# Altium project LimeSDR-USB_1v4.PrjPcb (part 4 of 8)

## Sheet FPGA.SchDoc: title
size A3; Author: NeoExiZ; CompanyName: BUPT CPS Lab; Engineer: NeoExiZ; Organization: NeoExiZ; Address1: 418, 4#Building,BUPT; Address2: No.10, Xitucheng Road; Address3: Beijing; Address4: China
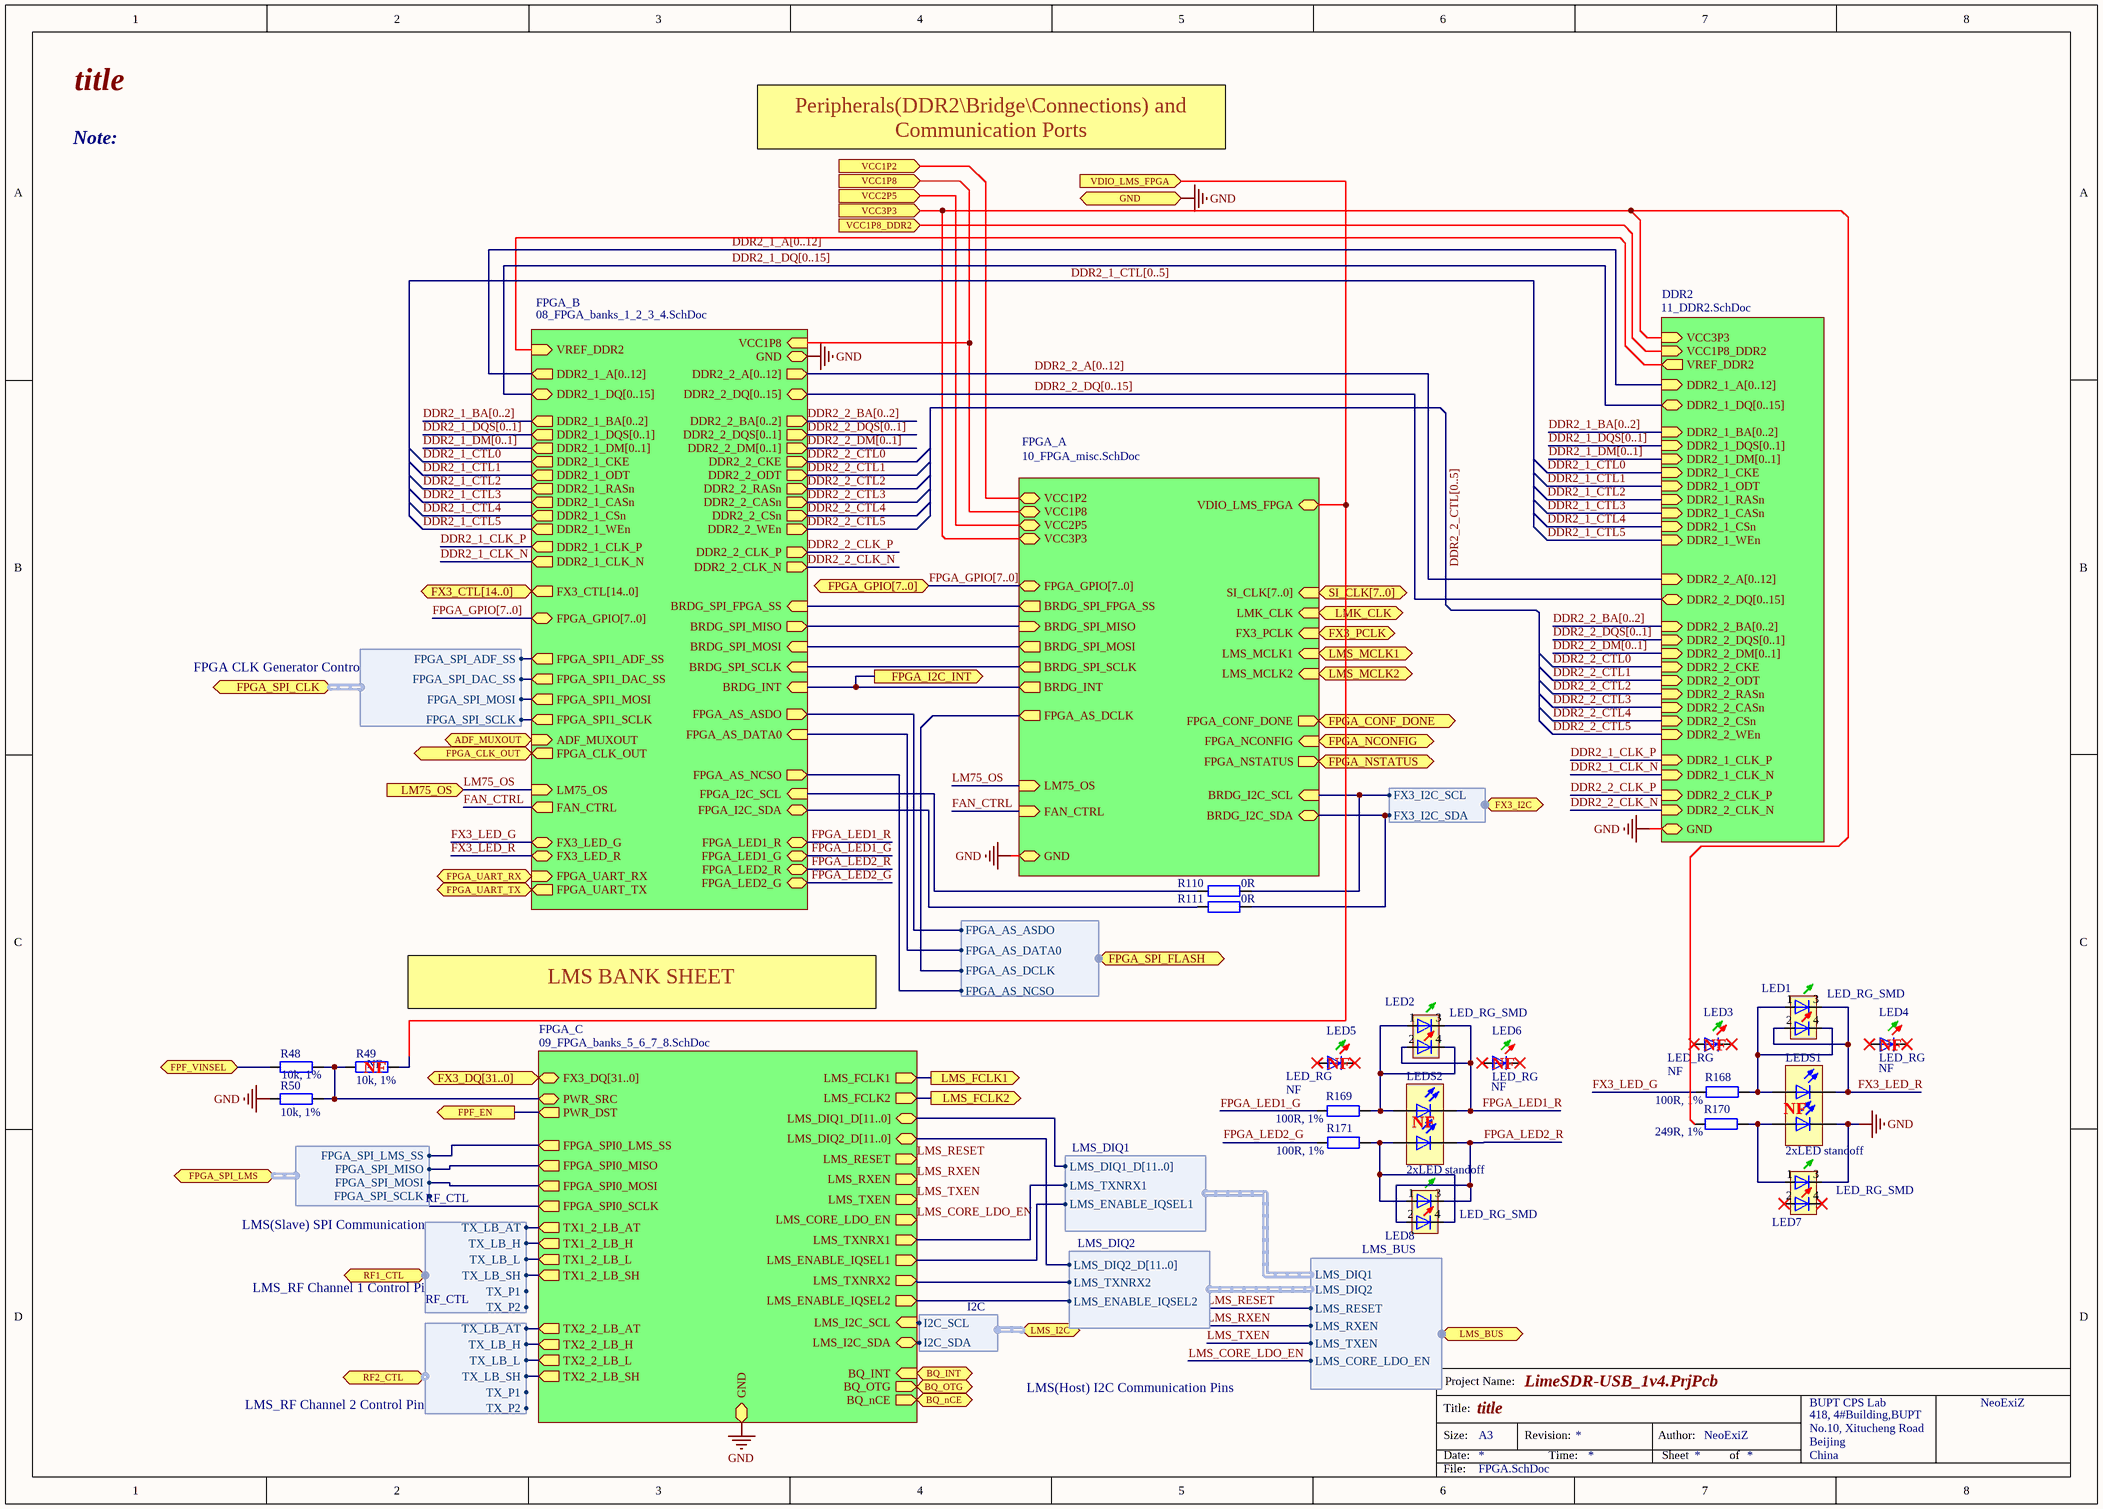
[diagram p6: FPGA.SchDoc]

### Parts
LED1  LED_RG_SMD  [LED-2x0603]
LED2  LED_RG_SMD  [LED-2x0603]
LED3  LED_RG  Assembly Info: NF  (mechanical)
LED4  LED_RG  Assembly Info: NF  (mechanical)
LED5  LED_RG  Assembly Info: NF  (mechanical)
LED6  LED_RG  Assembly Info: NF  (mechanical)
LED7  LED_RG_SMD  [LED-2x0603]
LED8  LED_RG_SMD  [LED-2x0603]
LEDS1  2xLED standoff  [LED_STANDOFF_H-201C]
LEDS2  2xLED standoff  [LED_STANDOFF_H-201C]
R48  10k, 1%  [RES0402]
R49  10k, 1%  Assembly Info: NF  [RES0402]
R50  10k, 1%  [RES0402]
R110  0R  [RES0402]
R111  0R  [RES0402]
R168  100R, 1%  [RES0402]
R169  100R, 1%  [RES0402]
R170  249R, 1%  [RES0402]
R171  100R, 1%  [RES0402]

### Sub-sheets
DDR2 = 11_DDR2.SchDoc: DDR2_1_ODT (in), DDR2_1_RASn (in), DDR2_1_WEn (in), DDR2_1_CKE (in), DDR2_1_CSn (in), DDR2_1_CASn (in), DDR2_1_BA[0..2] (in), DDR2_1_DM[0..1] (in), DDR2_1_DQS[0..1] (in), DDR2_1_A[0..12] (in), DDR2_1_DQ[0..15] (bidir), VCC1P8_DDR2 (in), VCC3P3 (in), VREF_DDR2 (out), DDR2_2_BA[0..2] (in), DDR2_2_CASn (in), DDR2_2_CKE (in), DDR2_2_CSn (in), DDR2_2_ODT (in), DDR2_2_RASn (in), DDR2_2_WEn (in), DDR2_2_DM[0..1] (in), DDR2_2_DQS[0..1] (in), DDR2_2_DQ[0..15] (bidir), DDR2_2_A[0..12] (in), DDR2_1_CLK_P (in), DDR2_1_CLK_N (in), DDR2_2_CLK_N (in), DDR2_2_CLK_P (in), GND
FPGA_A = 10_FPGA_misc.SchDoc: FX3_PCLK (in), SI_CLK[7..0] (in), FPGA_GPIO[7..0] (bidir), LMK_CLK (in), LMS_MCLK1 (in), LMS_MCLK2 (in), FPGA_AS_DCLK (out), FPGA_CONF_DONE (out), FPGA_NCONFIG (in), FPGA_NSTATUS (out), BRDG_SPI_FPGA_SS (out), BRDG_SPI_MISO (in), BRDG_SPI_MOSI (out), BRDG_SPI_SCLK (out), BRDG_INT (out), BRDG_I2C_SCL (in), BRDG_I2C_SDA (bidir), LM75_OS (in), FAN_CTRL (in), VCC1P2, VCC1P8, VCC3P3, VDIO_LMS_FPGA, VCC2P5, GND
FPGA_B = 08_FPGA_banks_1_2_3_4.SchDoc: FX3_CTL[14..0] (out), FPGA_GPIO[7..0] (bidir), BRDG_INT (in), BRDG_SPI_FPGA_SS (in), BRDG_SPI_MISO (out), BRDG_SPI_MOSI (in), BRDG_SPI_SCLK (in), FPGA_SPI1_ADF_SS (out), FPGA_SPI1_DAC_SS (out), FPGA_SPI1_MOSI (out), FPGA_SPI1_SCLK (out), FPGA_CLK_OUT (out), FPGA_AS_ASDO (out), FPGA_AS_DATA0 (in), FPGA_AS_NCSO (out), LM75_OS (in), FAN_CTRL (out), FPGA_I2C_SCL (in), FPGA_I2C_SDA (bidir), DDR2_1_ODT (out), DDR2_1_RASn (out), DDR2_1_WEn (out), DDR2_2_BA[0..2] (out), DDR2_2_CASn (out), DDR2_2_CKE (out), DDR2_2_CSn (out), DDR2_2_ODT (out), DDR2_2_RASn (out), DDR2_2_WEn (out), DDR2_1_CKE (out), DDR2_1_CSn (out), DDR2_1_CASn (out), DDR2_1_BA[0..2] (out), DDR2_1_DM[0..1] (out), DDR2_2_DM[0..1] (out), DDR2_2_DQS[0..1] (out), DDR2_1_DQS[0..1] (out), DDR2_1_A[0..12] (out), DDR2_1_DQ[0..15] (bidir), DDR2_2_DQ[0..15] (bidir), DDR2_2_A[0..12] (out), VREF_DDR2 (in), DDR2_2_CLK_N (out), DDR2_2_CLK_P (out), DDR2_1_CLK_N (out), DDR2_1_CLK_P (out), FPGA_LED1_R, FPGA_LED1_G, FPGA_LED2_G, FPGA_LED2_R, FX3_LED_G, FX3_LED_R, FPGA_UART_RX (in), FPGA_UART_TX (out), ADF_MUXOUT (in), VCC1P8 (in), GND
FPGA_C = 09_FPGA_banks_5_6_7_8.SchDoc: FX3_DQ[31..0] (bidir), LMS_FCLK2 (out), LMS_FCLK1 (out), LMS_DIQ1_D[11..0] (bidir), LMS_DIQ2_D[11..0] (bidir), FPGA_SPI0_MISO (out), FPGA_SPI0_MOSI (out), FPGA_SPI0_SCLK (out), FPGA_SPI0_LMS_SS (out), LMS_RESET (out), LMS_RXEN (out), LMS_TXEN (out), LMS_TXNRX1 (out), LMS_TXNRX2 (out), LMS_ENABLE_IQSEL1 (out), LMS_ENABLE_IQSEL2 (out), LMS_CORE_LDO_EN (out), LMS_I2C_SCL (in), LMS_I2C_SDA (bidir), TX1_2_LB_AT (out), TX1_2_LB_H (out), TX1_2_LB_L (out), TX1_2_LB_SH (out), TX2_2_LB_AT (out), TX2_2_LB_H (out), TX2_2_LB_L (out), TX2_2_LB_SH (out), PWR_SRC (bidir), GND, BQ_nCE (out), BQ_OTG (out), BQ_INT (in), PWR_DST (out)

### Ports
ADF_MUXOUT (in), BQ_INT (in), BQ_nCE (out), BQ_OTG (out), FPF_EN (out), FPF_VINSEL (bidir), FPGA_CLK_OUT (out), FPGA_CONF_DONE (out), FPGA_GPIO[7..0] (bidir), FPGA_I2C_INT (out), FPGA_NCONFIG (in), FPGA_NSTATUS (out), FPGA_SPI_CLK (harness FPGA_SPI_CLK), FPGA_SPI_FLASH (harness FPGA_SPI_FLASH), FPGA_SPI_LMS (harness FPGA_SPI_LMS), FPGA_UART_RX (in), FPGA_UART_TX (out), FX3_CTL[14..0] (out), FX3_DQ[31..0] (bidir), FX3_I2C (harness FX3_I2C), FX3_PCLK (in), GND, LM75_OS (in), LMK_CLK (in), LMS_BUS (harness LMS_BUS), LMS_FCLK1 (out), LMS_FCLK2 (out), LMS_I2C (harness I2C), LMS_MCLK1 (in), LMS_MCLK2 (in), RF1_CTL (harness RF_CTL), RF2_CTL (harness RF_CTL), SI_CLK[7..0] (in), VCC1P2 (in), VCC1P8 (in), VCC1P8_DDR2 (in), VCC2P5 (in), VCC3P3 (in), VDIO_LMS_FPGA (in)

### Harnesses
FPGA_SPI_CLK: FPGA_SPI_SCLK, FPGA_SPI_MOSI, FPGA_SPI_DAC_SS, FPGA_SPI_ADF_SS
FX3_I2C: FX3_I2C_SCL, FX3_I2C_SDA
FPGA_SPI_FLASH: FPGA_AS_ASDO, FPGA_AS_DATA0, FPGA_AS_DCLK, FPGA_AS_NCSO
FPGA_SPI_LMS: FPGA_SPI_LMS_SS, FPGA_SPI_MISO, FPGA_SPI_MOSI, FPGA_SPI_SCLK
I2C: I2C_SCL, I2C_SDA
LMS_DIQ1: LMS_DIQ1_D[11..0], LMS_TXNRX1, LMS_ENABLE_IQSEL1
LMS_DIQ2: LMS_DIQ2_D[11..0], LMS_TXNRX2, LMS_ENABLE_IQSEL2
LMS_BUS: LMS_DIQ1, LMS_DIQ2, LMS_RESET, LMS_RXEN, LMS_TXEN, LMS_CORE_LDO_EN
RF_CTL: TX_LB_AT, TX_LB_H, TX_LB_L, TX_LB_SH, TX_P1, TX_P2

### Nets
GND: LED7.3 LEDS1.K2(C) R50.1 ; port GND, sheet FPGA_C/GND, sheet FPGA_B/GND, sheet FPGA_A/GND, sheet DDR2/GND
VCC_P0: port VCC1P2, sheet FPGA_A/VCC1P2
VCC_P2: port VCC2P5, sheet FPGA_A/VCC2P5
VCC_P3: R170.1 ; port VCC3P3, sheet FPGA_A/VCC3P3, sheet DDR2/VCC3P3
VDIO_LMS_FPGA: R49.2 ; port VDIO_LMS_FPGA, sheet FPGA_A/VDIO_LMS_FPGA
VREF_DDR2: sheet FPGA_B/VREF_DDR2, sheet DDR2/VREF_DDR2
BQ_INT: port BQ_INT, sheet FPGA_C/BQ_INT
BQ_nCE: port BQ_nCE, sheet FPGA_C/BQ_nCE
BQ_OTG: port BQ_OTG, sheet FPGA_C/BQ_OTG
DDR2_1_CLK_N: sheet FPGA_B/DDR2_1_CLK_N, sheet DDR2/DDR2_1_CLK_N
DDR2_1_CLK_P: sheet FPGA_B/DDR2_1_CLK_P, sheet DDR2/DDR2_1_CLK_P
DDR2_1_CTL0: sheet FPGA_B/DDR2_1_CKE, sheet DDR2/DDR2_1_CKE
DDR2_1_CTL1: sheet FPGA_B/DDR2_1_ODT, sheet DDR2/DDR2_1_ODT
DDR2_1_CTL2: sheet FPGA_B/DDR2_1_RASn, sheet DDR2/DDR2_1_RASn
DDR2_1_CTL3: sheet FPGA_B/DDR2_1_CASn, sheet DDR2/DDR2_1_CASn
DDR2_1_CTL4: sheet FPGA_B/DDR2_1_CSn, sheet DDR2/DDR2_1_CSn
DDR2_1_CTL5: sheet FPGA_B/DDR2_1_WEn, sheet DDR2/DDR2_1_WEn
DDR2_2_CLK_N: sheet FPGA_B/DDR2_2_CLK_N, sheet DDR2/DDR2_2_CLK_N
DDR2_2_CLK_P: sheet FPGA_B/DDR2_2_CLK_P, sheet DDR2/DDR2_2_CLK_P
DDR2_2_CTL0: sheet FPGA_B/DDR2_2_CKE, sheet DDR2/DDR2_2_CKE
DDR2_2_CTL1: sheet FPGA_B/DDR2_2_ODT, sheet DDR2/DDR2_2_ODT
DDR2_2_CTL2: sheet FPGA_B/DDR2_2_RASn, sheet DDR2/DDR2_2_RASn
DDR2_2_CTL3: sheet FPGA_B/DDR2_2_CASn, sheet DDR2/DDR2_2_CASn
DDR2_2_CTL4: sheet FPGA_B/DDR2_2_CSn, sheet DDR2/DDR2_2_CSn
DDR2_2_CTL5: sheet FPGA_B/DDR2_2_WEn, sheet DDR2/DDR2_2_WEn
FAN_CTRL: sheet FPGA_B/FAN_CTRL, sheet FPGA_A/FAN_CTRL
FPF_EN: port FPF_EN, sheet FPGA_C/PWR_DST
FPF_VINSEL: R48.1 ; port FPF_VINSEL
FPGA_CONF_DONE: port FPGA_CONF_DONE, sheet FPGA_A/FPGA_CONF_DONE
FPGA_LED1_G: R169.1 ; sheet FPGA_B/FPGA_LED1_G
FPGA_LED1_R: LED2.2 LED2.3 LEDS2.K1(C) ; sheet FPGA_B/FPGA_LED1_R
FPGA_LED2_G: R171.1 ; sheet FPGA_B/FPGA_LED2_G
FPGA_LED2_R: LED8.2 LED8.3 LEDS2.K2(C) ; sheet FPGA_B/FPGA_LED2_R
FPGA_NCONFIG: port FPGA_NCONFIG, sheet FPGA_A/FPGA_NCONFIG
FPGA_NSTATUS: port FPGA_NSTATUS, sheet FPGA_A/FPGA_NSTATUS
FX3_I2C_SCL: R110.2 ; sheet FPGA_A/BRDG_I2C_SCL, port FX3_I2C.FX3_I2C_SCL
FX3_I2C_SDA: R111.2 ; sheet FPGA_A/BRDG_I2C_SDA, port FX3_I2C.FX3_I2C_SDA
FX3_LED_G: R168.1 ; sheet FPGA_B/FX3_LED_G
FX3_LED_R: LED1.2 LED1.3 LEDS1.K1(C) ; sheet FPGA_B/FX3_LED_R
FX3_PCLK: port FX3_PCLK, sheet FPGA_A/FX3_PCLK
LM75_OS: port LM75_OS, sheet FPGA_B/LM75_OS, sheet FPGA_A/LM75_OS
LMK_CLK: port LMK_CLK, sheet FPGA_A/LMK_CLK
LMS_CORE_LDO_EN: sheet FPGA_C/LMS_CORE_LDO_EN, port LMS_BUS.LMS_CORE_LDO_EN
LMS_ENABLE_IQSEL1: sheet FPGA_C/LMS_ENABLE_IQSEL1, harness LMS_DIQ1.LMS_ENABLE_IQSEL1
LMS_ENABLE_IQSEL2: sheet FPGA_C/LMS_ENABLE_IQSEL2, harness LMS_DIQ2.LMS_ENABLE_IQSEL2
LMS_FCLK1: port LMS_FCLK1, sheet FPGA_C/LMS_FCLK1
LMS_FCLK2: port LMS_FCLK2, sheet FPGA_C/LMS_FCLK2
LMS_I2C_SCL: sheet FPGA_C/LMS_I2C_SCL, port LMS_I2C.I2C_SCL
LMS_I2C_SDA: sheet FPGA_C/LMS_I2C_SDA, port LMS_I2C.I2C_SDA
LMS_MCLK1: port LMS_MCLK1, sheet FPGA_A/LMS_MCLK1
LMS_MCLK2: port LMS_MCLK2, sheet FPGA_A/LMS_MCLK2
LMS_RESET: sheet FPGA_C/LMS_RESET, port LMS_BUS.LMS_RESET
LMS_RXEN: sheet FPGA_C/LMS_RXEN, port LMS_BUS.LMS_RXEN
LMS_TXEN: sheet FPGA_C/LMS_TXEN, port LMS_BUS.LMS_TXEN
LMS_TXNRX1: sheet FPGA_C/LMS_TXNRX1, harness LMS_DIQ1.LMS_TXNRX1
LMS_TXNRX2: sheet FPGA_C/LMS_TXNRX2, harness LMS_DIQ2.LMS_TXNRX2
TX1_2_LB_AT: sheet FPGA_C/TX2_2_LB_AT, port RF2_CTL.TX_LB_AT
TX1_2_LB_H: sheet FPGA_C/TX2_2_LB_H, port RF2_CTL.TX_LB_H
TX1_2_LB_L: sheet FPGA_C/TX2_2_LB_L, port RF2_CTL.TX_LB_L
TX1_2_LB_SH: sheet FPGA_C/TX2_2_LB_SH, port RF2_CTL.TX_LB_SH
TX2_2_LB_AT: sheet FPGA_C/TX1_2_LB_AT, port RF1_CTL.TX_LB_AT
TX2_2_LB_H: sheet FPGA_C/TX1_2_LB_H, port RF1_CTL.TX_LB_H
TX2_2_LB_L: sheet FPGA_C/TX1_2_LB_L, port RF1_CTL.TX_LB_L
TX2_2_LB_SH: sheet FPGA_C/TX1_2_LB_SH, port RF1_CTL.TX_LB_SH
VCC1P8: port VCC1P8, sheet FPGA_B/VCC1P8, sheet FPGA_A/VCC1P8
VCC_P4: port VCC1P8_DDR2, sheet DDR2/VCC1P8_DDR2
NetIC8_B1: sheet FPGA_B/BRDG_SPI_MOSI, sheet FPGA_A/BRDG_SPI_MOSI
NetIC8_B2: sheet FPGA_B/BRDG_SPI_SCLK, sheet FPGA_A/BRDG_SPI_SCLK
NetIC8_B22: R48.2 R49.1 R50.2 ; sheet FPGA_C/PWR_SRC
NetIC8_C1: sheet FPGA_B/BRDG_SPI_MISO, sheet FPGA_A/BRDG_SPI_MISO
NetIC8_C2: port FPGA_CLK_OUT, sheet FPGA_B/FPGA_CLK_OUT
NetIC8_C8: sheet FPGA_C/FPGA_SPI0_MISO, port FPGA_SPI_LMS.FPGA_SPI_MISO
NetIC8_D1: sheet FPGA_B/FPGA_AS_ASDO, port FPGA_SPI_FLASH.FPGA_AS_ASDO
NetIC8_D7: sheet FPGA_C/FPGA_SPI0_MOSI, port FPGA_SPI_LMS.FPGA_SPI_MOSI
NetIC8_D10: sheet FPGA_C/FPGA_SPI0_LMS_SS, port FPGA_SPI_LMS.FPGA_SPI_LMS_SS
NetIC8_E2: sheet FPGA_B/FPGA_AS_NCSO, port FPGA_SPI_FLASH.FPGA_AS_NCSO
NetIC8_E6: sheet FPGA_C/FPGA_SPI0_SCLK, port FPGA_SPI_LMS.FPGA_SPI_SCLK
NetIC8_H7: R110.1 ; sheet FPGA_B/FPGA_I2C_SCL
NetIC8_J1: port FPGA_UART_RX, sheet FPGA_B/FPGA_UART_RX
NetIC8_J2: port ADF_MUXOUT, sheet FPGA_B/ADF_MUXOUT
NetIC8_J3: sheet FPGA_B/FPGA_SPI1_DAC_SS, port FPGA_SPI_CLK.FPGA_SPI_DAC_SS
NetIC8_J5: sheet FPGA_B/FPGA_SPI1_ADF_SS, port FPGA_SPI_CLK.FPGA_SPI_ADF_SS
NetIC8_J7: R111.1 ; sheet FPGA_B/FPGA_I2C_SDA
NetIC8_J8: port FPGA_UART_TX, sheet FPGA_B/FPGA_UART_TX
NetIC8_K1: sheet FPGA_B/FPGA_AS_DATA0, port FPGA_SPI_FLASH.FPGA_AS_DATA0
NetIC8_K7: sheet FPGA_B/BRDG_SPI_FPGA_SS, sheet FPGA_A/BRDG_SPI_FPGA_SS
NetIC8_K8: sheet FPGA_B/FPGA_SPI1_SCLK, port FPGA_SPI_CLK.FPGA_SPI_SCLK
NetIC8_L8: sheet FPGA_B/FPGA_SPI1_MOSI, port FPGA_SPI_CLK.FPGA_SPI_MOSI
NetIC8_R1: port FPGA_I2C_INT, sheet FPGA_B/BRDG_INT, sheet FPGA_A/BRDG_INT
NetIC25#1_K2: sheet FPGA_A/FPGA_AS_DCLK, port FPGA_SPI_FLASH.FPGA_AS_DCLK
NetLED1_1: LED1.1 LED1.4 LEDS1.A1(A) R168.2
NetLED2_1: LED2.1 LED2.4 LEDS2.A1(A) R169.2
NetLED7_1: LED7.1 LEDS1.A2(A) R170.2
NetLED8_1: LED8.1 LED8.4 LEDS2.A2(A) R171.2

Not connected (* = marked no-connect by the designer): LED3 A* K(C)*; LED4 A* K(C)*; LED5 A* K(C)*; LED6 A* K(C)*; LED7 2* 4*

### Buses and harness runs
bus DDR2_1_A[0..12] = sheet DDR2/DDR2_1_A[0..12] = sheet FPGA_B/DDR2_1_A[0..12]
bus DDR2_1_BA[0..2] = sheet DDR2/DDR2_1_BA[0..2]
bus DDR2_1_BA[0..2] = sheet FPGA_B/DDR2_1_BA[0..2]
bus DDR2_1_CTL[0..5]
bus DDR2_1_DM[0..1] = sheet DDR2/DDR2_1_DM[0..1]
bus DDR2_1_DM[0..1] = sheet FPGA_B/DDR2_1_DM[0..1]
bus DDR2_1_DQ[0..15] = sheet DDR2/DDR2_1_DQ[0..15] = sheet FPGA_B/DDR2_1_DQ[0..15]
bus DDR2_1_DQS[0..1] = sheet DDR2/DDR2_1_DQS[0..1]
bus DDR2_1_DQS[0..1] = sheet FPGA_B/DDR2_1_DQS[0..1]
bus DDR2_2_A[0..12] = sheet DDR2/DDR2_2_A[0..12] = sheet FPGA_B/DDR2_2_A[0..12]
bus DDR2_2_BA[0..2] = sheet DDR2/DDR2_2_BA[0..2]
bus DDR2_2_BA[0..2] = sheet FPGA_B/DDR2_2_BA[0..2]
bus DDR2_2_CTL[0..5]
bus DDR2_2_DM[0..1] = sheet DDR2/DDR2_2_DM[0..1]
bus DDR2_2_DM[0..1] = sheet FPGA_B/DDR2_2_DM[0..1]
bus DDR2_2_DQ[0..15] = sheet DDR2/DDR2_2_DQ[0..15] = sheet FPGA_B/DDR2_2_DQ[0..15]
bus DDR2_2_DQS[0..1] = sheet DDR2/DDR2_2_DQS[0..1]
bus DDR2_2_DQS[0..1] = sheet FPGA_B/DDR2_2_DQS[0..1]
bus FPGA_GPIO[7..0] = port FPGA_GPIO[7..0] = sheet FPGA_A/FPGA_GPIO[7..0]
bus FPGA_GPIO[7..0] = sheet FPGA_B/FPGA_GPIO[7..0]
bus port FX3_CTL[14..0] = sheet FPGA_B/FX3_CTL[14..0]
bus port FX3_DQ[31..0] = sheet FPGA_C/FX3_DQ[31..0]
bus port SI_CLK[7..0] = sheet FPGA_A/SI_CLK[7..0]

### Notes on the sheet
- Peripherals(DDR2\Bridge\Connections) and Communication Ports
- FPGA CLK Generator Control
- LMS BANK SHEET
- (near LED3) NF
- (near LED4) NF
- (near R49) NF
- (near LED5) NF
- (near LEDS2) NF
- (near LED6) NF
- (near LEDS1) NF
- LMS(Slave) SPI Communication
- LMS_RF Channel 1 Control Pin
- LMS(Host) I2C Communication Pins
- LMS_RF Channel 2 Control Pin
- Note:
- Project Name:
- Size:
- Date:
- Title:
- A3
- Revision:
- Time:
- Author:
- Sheet
- of
- File:

### Library data of the parts
LED1 LED2 LED7 LED8 = LED_green_red_SMD: Manufacturer Part Number 1: HSMF-C165; Manufacturer: Avago Technologies US Inc.; Part Description: LED GREEN/RED DIFFUSED 0603 SMD; Millicandela Rating: 15mcd Green, 10mcd Red; Lens Transparency: Diffused; Lens Color: White; Lens Style/Size: Rectangle with Flat Top, 1.60mm x 0.80mm; Wavelength - Peak: 570nm Green, 636nm Red; Wavelength - Dominant: 572nm Green, 621nm Red; Viewing Angle: 120°; Voltage - Forward (Vf) (Typ): 2.2V Green, 1.95V Red; Current - Test: 20mA; Color: Green, Red; Supplier 1: Digi-Key; Height (Max): 0.50mm; Packaging: Cut Tape (CT); Category: Optoelectronics; Mounting Type: Surface Mount; Package / Case: 0603 (1608 Metric); Size / Dimension: 1.60mm L x 0.80mm W; Supplier Device Package: *; RoHS: RoHS Compliant; Supplier Part Number 1: 516-1419-1-ND
LED3-LED6 = LED_green_red: Manufacturer Part Number 1: 4301F1/5; Manufacturer: Visual Communications Company - VCC; Part Description: LED GRN/RED DIFF 3MM ROUND T/H; Voltage - Forward (Vf) (Typ): 2.1V Green, 1.8V Red; Lens Color: White; Lens Style/Size: Round with Domed Top, 3mm (T-1), 2.90mm; Millicandela Rating: 12.6mcd Green, 3.7mcd Red; Color: Green, Red; Viewing Angle: 100°; Lens Transparency: Diffused; Current - Test: 20mA Green, 20mA Red; Wavelength - Peak: 565nm Green, 660nm Red; Supplier 1: Digi-Key; Supplier Part Number 1: 4301F1/5-ND; RoHS: RoHS Compliant; Packaging: Bulk; Package / Case: Radial; Mounting Type: Through Hole; Wavelength - Dominant: -; Supplier Device Package: T-1; Size / Dimension: -; Category: Optoelectronics; Height (Max): 5.44mm
LEDS1 LEDS2 = LEDx2_STANDOFF
R48-R50 = Res_0402: as R115-R117 on sheet 12_USB3_0_device; Value: 10k, 1%; Supplier 1: Digi-Key; Supplier Part Number 1: 311-10.0KLRTR-ND; Resistance (Ohms): 10k; Packaging: Tape & Reel (TR); RoHS: RoHS Compliant; Package / Case: 0402 (1005 Metric); Tolerance: ±1%; Operating Temperature: -55°C ~ 155°C; Size / Dimension: 0.039" L x 0.020" W (1.00mm x 0.50mm); Number of Terminations: 2; Category: Resistors; Height: 0.016" (0.40mm); Supplier Device Package: 0402; Features: Moisture Resistant; Composition: Thick Film
R110 R111 = Res_0402: as R92 on sheet 12_USB3_0_device; Supplier 1: Digi-Key; Supplier Part Number 1: 311-0.0JRTR-ND; Composition: Thick Film; Package / Case: 0402 (1005 Metric); Category: Resistors; Value: 0R
R168 R169 R171 = Res_0402: Manufacturer Part Number 1: RMCF0402FT100R; Manufacturer: Stackpole Electronics Inc.; Part Description: RES SMD 100 OHM 1% 1/16W 0402; Power (Watts): 0.063W, 1/16W; Temperature Coefficient: ±100ppm/°C; Resistance (Ohms): 100; Value: 100R, 1%; Supplier 1: Digi-Key; Supplier Part Number 1: RMCF0402FT100RDKR-ND; Packaging: Digi-Reel®; Composition: Thick Film; Number of Terminations: 2; Package / Case: 0402 (1005 Metric); RoHS: RoHS Compliant; Category: Resistors; Size / Dimension: 0.039" L x 0.020" W (1.00mm x 0.50mm); Tolerance: ±1%; Supplier Device Package: 0402; Features: -; Height: 0.016" (0.40mm); Operating Temperature: -55°C ~ 155°C
R170 = Res_0402: Manufacturer Part Number 1: RMCF0402FT249R; Manufacturer: Stackpole Electronics Inc; Part Description: RES SMD 249 OHM 1% 1/16W 0402; Resistance (Ohms): 249; Power (Watts): 0.063W, 1/16W; Temperature Coefficient: ±100ppm/°C; Value: 249R, 1%; Supplier 1: Digi-Key; Supplier Part Number 1: RMCF0402FT249RCT-ND; Package / Case: 0402 (1005 Metric); Features: -; Size / Dimension: 0.039" L x 0.020" W (1.00mm x 0.50mm); Category: Resistors; Operating Temperature: -55°C ~ 155°C; Packaging: Cut Tape (CT); Tolerance: ±1%; Supplier Device Package: 0402; RoHS: RoHS Compliant; Composition: Thick Film; Number of Terminations: 2; Height: 0.016" (0.40mm)

## Sheet 09_FPGA_banks_5_6_7_8.SchDoc: FPGA banks 5, 6, 7, 8
size A3; Organization: Lime Microsystems; Address1: Surrey Tech Centre; Address2: Guildford GU2 7YG; Address3: Surrey; Address4: United Kingdom; Revision: v1.4; SheetNumber: 9; SheetTotal: 15
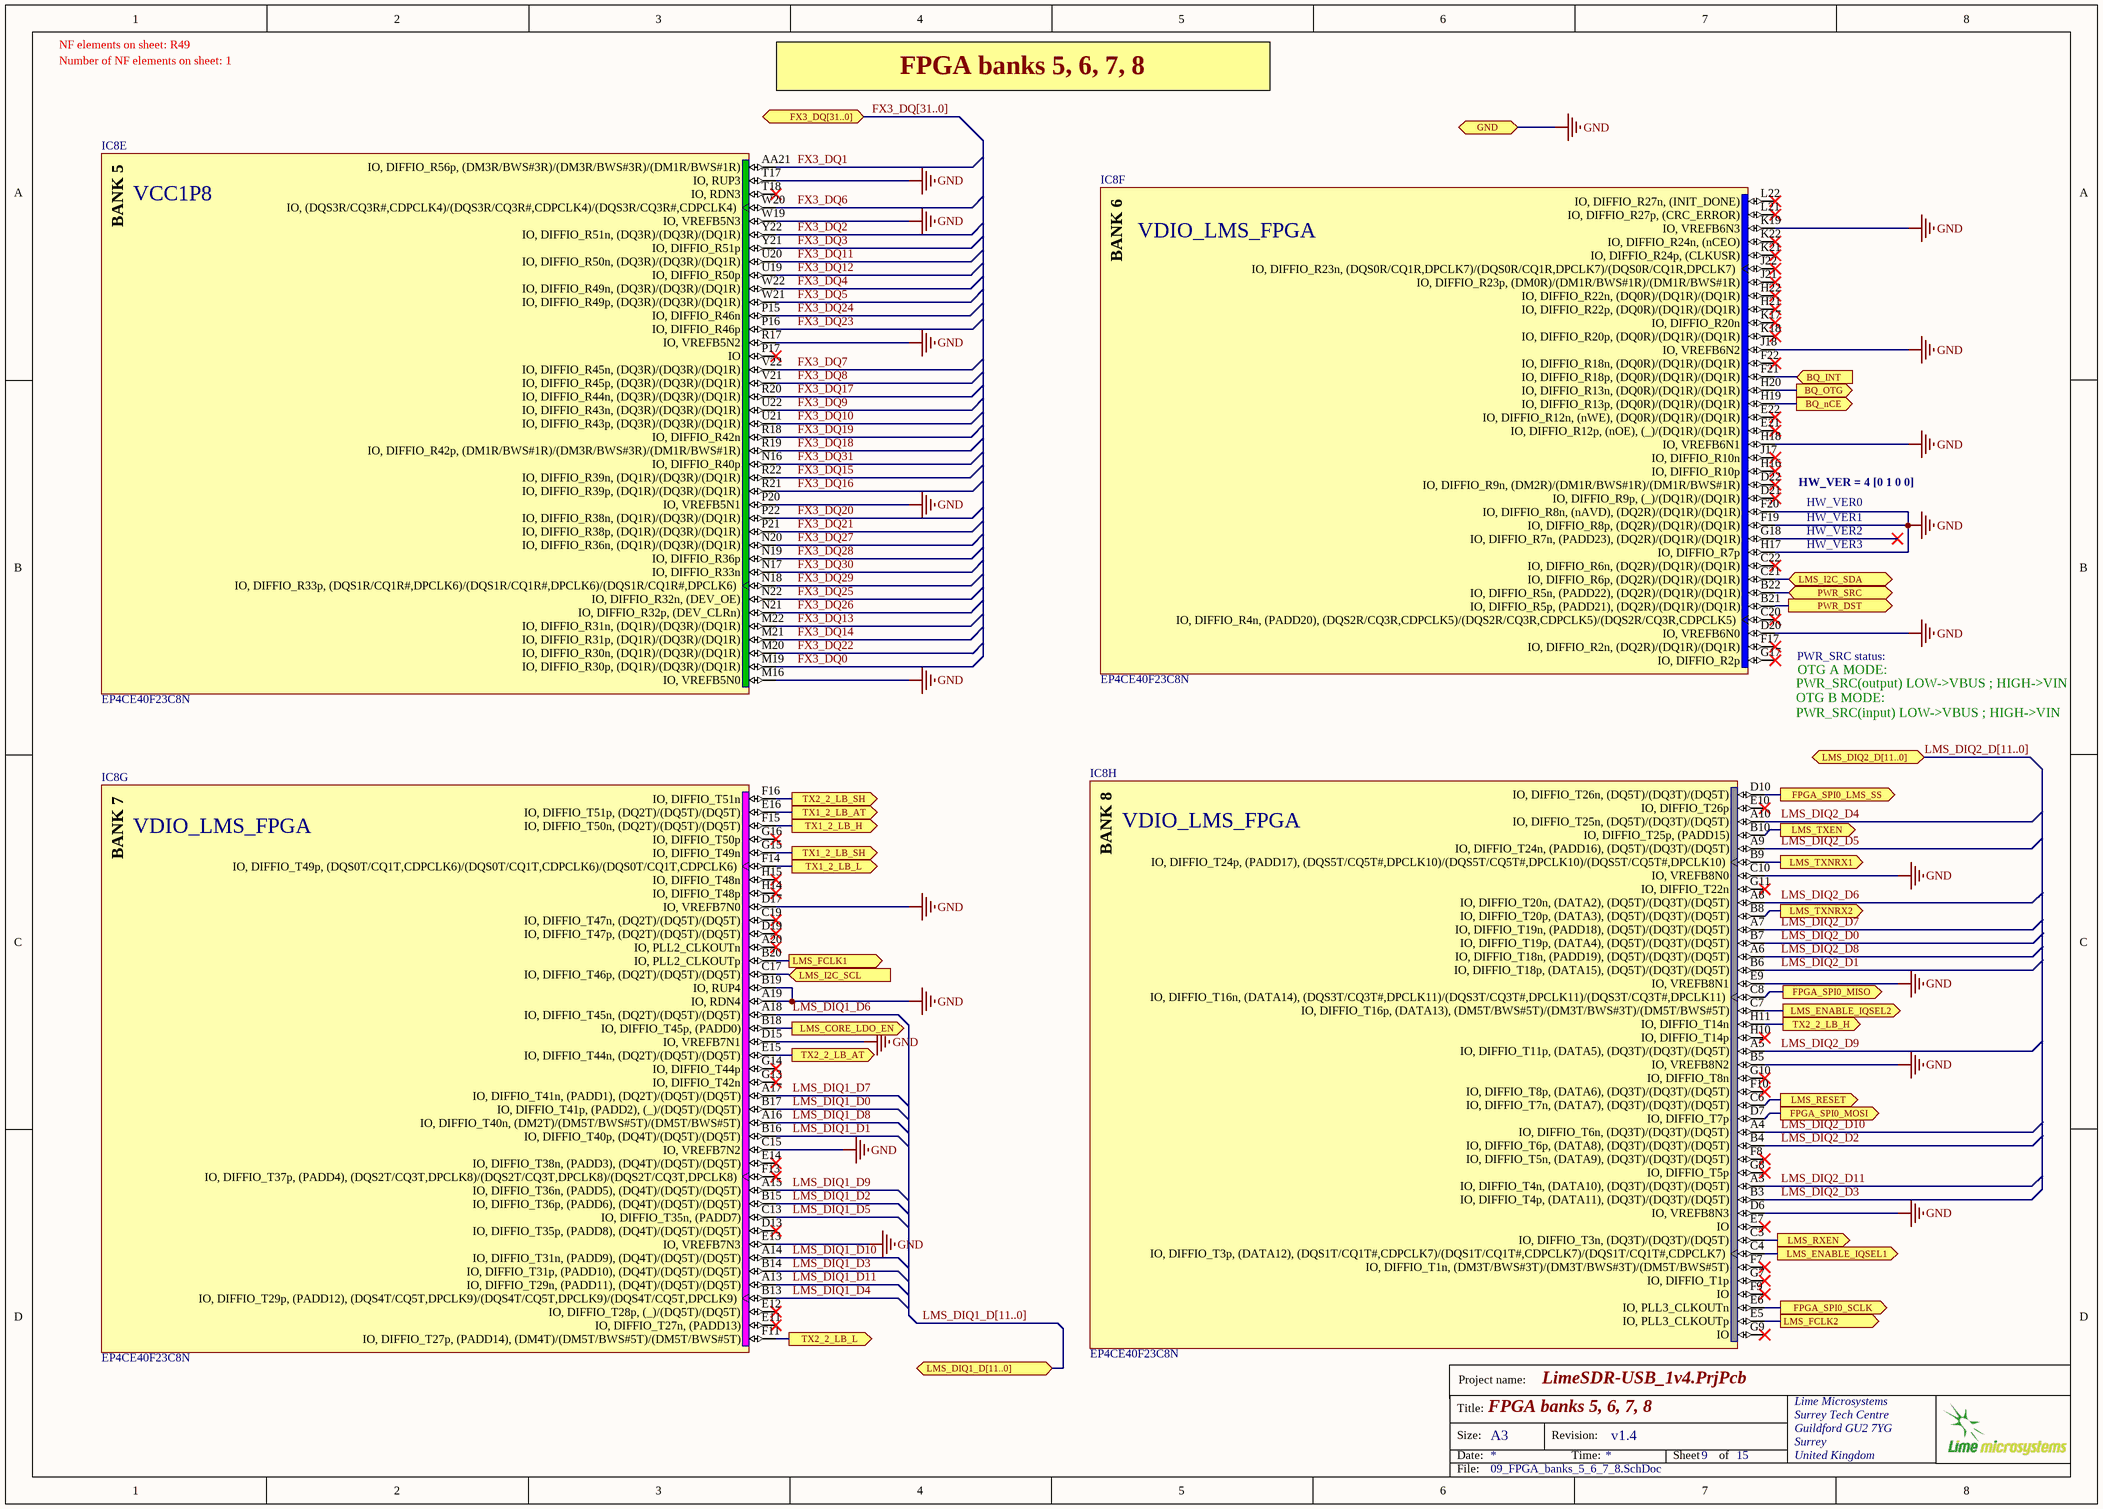
[diagram p7: 09_FPGA_banks_5_6_7_8.SchDoc]

### Parts
IC8  EP4CE40F23C8N  [FBGA484_A-240]  (parts E,F,G,H of 13)

### Ports
BQ_INT (in), BQ_nCE (out), BQ_OTG (out), FPGA_SPI0_LMS_SS (out), FPGA_SPI0_MISO (out), FPGA_SPI0_MOSI (out), FPGA_SPI0_SCLK (out), FX3_DQ[31..0] (bidir), GND, LMS_CORE_LDO_EN (out), LMS_DIQ1_D[11..0] (bidir), LMS_DIQ2_D[11..0] (bidir), LMS_ENABLE_IQSEL1 (out), LMS_ENABLE_IQSEL2 (out), LMS_FCLK1 (out), LMS_FCLK2 (out), LMS_I2C_SCL (in), LMS_I2C_SDA (bidir), LMS_RESET (out), LMS_RXEN (out), LMS_TXEN (out), LMS_TXNRX1 (out), LMS_TXNRX2 (out), PWR_DST (out), PWR_SRC (bidir), TX1_2_LB_AT (out), TX1_2_LB_H (out), TX1_2_LB_L (out), TX1_2_LB_SH (out), TX2_2_LB_AT (out), TX2_2_LB_H (out), TX2_2_LB_L (out), TX2_2_LB_SH (out)

### Nets
GND: IC8.A19(IO,_RDN4) IC8.B5(IO,_VREFB8N2) IC8.B19(IO,_RUP4) IC8.C10(IO,_VREFB8N0) IC8.C15(IO,_VREFB7N2) IC8.D6(IO,_VREFB8N3) IC8.D15(IO,_VREFB7N1) IC8.D17(IO,_VREFB7N0) IC8.D20(IO,_VREFB6N0) IC8.E9(IO,_VREFB8N1) IC8.E13(IO,_VREFB7N3) IC8.F19(IO,_DIFFIO_R8p,_(DQ2R)/(DQ1R)/(DQ1R)) IC8.F20(IO,_DIFFIO_R8n,_(nAVD),_(DQ2R)/(DQ1R)/(DQ1R)) IC8.H17(IO,_DIFFIO_R7p) IC8.H18(IO,_VREFB6N1) IC8.J18(IO,_VREFB6N2) IC8.K19(IO,_VREFB6N3) IC8.M16(IO,_VREFB5N0) IC8.P20(IO,_VREFB5N1) IC8.R17(IO,_VREFB5N2) IC8.T17(IO,_RUP3) IC8.W19(IO,_VREFB5N3) ; port GND
BQ_INT: IC8.F21(IO,_DIFFIO_R18p,_(DQ0R)/(DQ1R)/(DQ1R)) ; port BQ_INT
BQ_nCE: IC8.H19(IO,_DIFFIO_R13p,_(DQ0R)/(DQ1R)/(DQ1R)) ; port BQ_nCE
BQ_OTG: IC8.H20(IO,_DIFFIO_R13n,_(DQ0R)/(DQ1R)/(DQ1R)) ; port BQ_OTG
FPF_EN: IC8.B21(IO,_DIFFIO_R5p,_(PADD21),_(DQ2R)/(DQ1R)/(DQ1R)) ; port PWR_DST
FX3_DQ0: IC8.M19(IO,_DIFFIO_R30p,_(DQ1R)/(DQ3R)/(DQ1R))
FX3_DQ1: IC8.AA21(IO,_DIFFIO_R56p,_(DM3R/BWS#3R)/(DM3R/BWS#3R)/(DM1R/BWS#1R))
FX3_DQ2: IC8.Y22(IO,_DIFFIO_R51n,_(DQ3R)/(DQ3R)/(DQ1R))
FX3_DQ3: IC8.Y21(IO,_DIFFIO_R51p)
FX3_DQ4: IC8.W22(IO,_DIFFIO_R49n,_(DQ3R)/(DQ3R)/(DQ1R))
FX3_DQ5: IC8.W21(IO,_DIFFIO_R49p,_(DQ3R)/(DQ3R)/(DQ1R))
FX3_DQ6: IC8.W20(IO,_(DQS3R/CQ3R#,CDPCLK4)/(DQS3R/CQ3R#,CDPCLK4)/(DQS3R/CQ3R#,CDPCLK4))
FX3_DQ7: IC8.V22(IO,_DIFFIO_R45n,_(DQ3R)/(DQ3R)/(DQ1R))
FX3_DQ8: IC8.V21(IO,_DIFFIO_R45p,_(DQ3R)/(DQ3R)/(DQ1R))
FX3_DQ9: IC8.U22(IO,_DIFFIO_R43n,_(DQ3R)/(DQ3R)/(DQ1R))
FX3_DQ10: IC8.U21(IO,_DIFFIO_R43p,_(DQ3R)/(DQ3R)/(DQ1R))
FX3_DQ11: IC8.U20(IO,_DIFFIO_R50n,_(DQ3R)/(DQ3R)/(DQ1R))
FX3_DQ12: IC8.U19(IO,_DIFFIO_R50p)
FX3_DQ13: IC8.M22(IO,_DIFFIO_R31n,_(DQ1R)/(DQ3R)/(DQ1R))
FX3_DQ14: IC8.M21(IO,_DIFFIO_R31p,_(DQ1R)/(DQ3R)/(DQ1R))
FX3_DQ15: IC8.R22(IO,_DIFFIO_R39n,_(DQ1R)/(DQ3R)/(DQ1R))
FX3_DQ16: IC8.R21(IO,_DIFFIO_R39p,_(DQ1R)/(DQ3R)/(DQ1R))
FX3_DQ17: IC8.R20(IO,_DIFFIO_R44n,_(DQ3R)/(DQ3R)/(DQ1R))
FX3_DQ18: IC8.R19(IO,_DIFFIO_R42p,_(DM1R/BWS#1R)/(DM3R/BWS#3R)/(DM1R/BWS#1R))
FX3_DQ19: IC8.R18(IO,_DIFFIO_R42n)
FX3_DQ20: IC8.P22(IO,_DIFFIO_R38n,_(DQ1R)/(DQ3R)/(DQ1R))
FX3_DQ21: IC8.P21(IO,_DIFFIO_R38p,_(DQ1R)/(DQ3R)/(DQ1R))
FX3_DQ22: IC8.M20(IO,_DIFFIO_R30n,_(DQ1R)/(DQ3R)/(DQ1R))
FX3_DQ23: IC8.P16(IO,_DIFFIO_R46p)
FX3_DQ24: IC8.P15(IO,_DIFFIO_R46n)
FX3_DQ25: IC8.N22(IO,_DIFFIO_R32n,_(DEV_OE))
FX3_DQ26: IC8.N21(IO,_DIFFIO_R32p,_(DEV_CLRn))
FX3_DQ27: IC8.N20(IO,_DIFFIO_R36n,_(DQ1R)/(DQ3R)/(DQ1R))
FX3_DQ28: IC8.N19(IO,_DIFFIO_R36p)
FX3_DQ29: IC8.N18(IO,_DIFFIO_R33p,_(DQS1R/CQ1R#,DPCLK6)/(DQS1R/CQ1R#,DPCLK6)/(DQS1R/CQ1R#,DPCLK6))
FX3_DQ30: IC8.N17(IO,_DIFFIO_R33n)
FX3_DQ31: IC8.N16(IO,_DIFFIO_R40p)
LMS_CORE_LDO_EN: IC8.B18(IO,_DIFFIO_T45p,_(PADD0)) ; port LMS_CORE_LDO_EN
LMS_DIQ1_D0: IC8.B17(IO,_DIFFIO_T41p,_(PADD2),_(_)/(DQ5T)/(DQ5T))
LMS_DIQ1_D1: IC8.B16(IO,_DIFFIO_T40p,_(DQ4T)/(DQ5T)/(DQ5T))
LMS_DIQ1_D2: IC8.B15(IO,_DIFFIO_T36p,_(PADD6),_(DQ4T)/(DQ5T)/(DQ5T))
LMS_DIQ1_D3: IC8.B14(IO,_DIFFIO_T31p,_(PADD10),_(DQ4T)/(DQ5T)/(DQ5T))
LMS_DIQ1_D4: IC8.B13(IO,_DIFFIO_T29p,_(PADD12),_(DQS4T/CQ5T,DPCLK9)/(DQS4T/CQ5T,DPCLK9)/(DQS4T/CQ5T,DPCLK9))
LMS_DIQ1_D5: IC8.C13(IO,_DIFFIO_T35n,_(PADD7))
LMS_DIQ1_D6: IC8.A18(IO,_DIFFIO_T45n,_(DQ2T)/(DQ5T)/(DQ5T))
LMS_DIQ1_D7: IC8.A17(IO,_DIFFIO_T41n,_(PADD1),_(DQ2T)/(DQ5T)/(DQ5T))
LMS_DIQ1_D8: IC8.A16(IO,_DIFFIO_T40n,_(DM2T)/(DM5T/BWS#5T)/(DM5T/BWS#5T))
LMS_DIQ1_D9: IC8.A15(IO,_DIFFIO_T36n,_(PADD5),_(DQ4T)/(DQ5T)/(DQ5T))
LMS_DIQ1_D10: IC8.A14(IO,_DIFFIO_T31n,_(PADD9),_(DQ4T)/(DQ5T)/(DQ5T))
LMS_DIQ1_D11: IC8.A13(IO,_DIFFIO_T29n,_(PADD11),_(DQ4T)/(DQ5T)/(DQ5T))
LMS_DIQ2_D0: IC8.B7(IO,_DIFFIO_T19p,_(DATA4),_(DQ5T)/(DQ3T)/(DQ5T))
LMS_DIQ2_D1: IC8.B6(IO,_DIFFIO_T18p,_(DATA15),_(DQ5T)/(DQ3T)/(DQ5T))
LMS_DIQ2_D2: IC8.B4(IO,_DIFFIO_T6p,_(DATA8),_(DQ3T)/(DQ3T)/(DQ5T))
LMS_DIQ2_D3: IC8.B3(IO,_DIFFIO_T4p,_(DATA11),_(DQ3T)/(DQ3T)/(DQ5T))
LMS_DIQ2_D4: IC8.A10(IO,_DIFFIO_T25n,_(DQ5T)/(DQ3T)/(DQ5T))
LMS_DIQ2_D5: IC8.A9(IO,_DIFFIO_T24n,_(PADD16),_(DQ5T)/(DQ3T)/(DQ5T))
LMS_DIQ2_D6: IC8.A8(IO,_DIFFIO_T20n,_(DATA2),_(DQ5T)/(DQ3T)/(DQ5T))
LMS_DIQ2_D7: IC8.A7(IO,_DIFFIO_T19n,_(PADD18),_(DQ5T)/(DQ3T)/(DQ5T))
LMS_DIQ2_D8: IC8.A6(IO,_DIFFIO_T18n,_(PADD19),_(DQ5T)/(DQ3T)/(DQ5T))
LMS_DIQ2_D9: IC8.A5(IO,_DIFFIO_T11p,_(DATA5),_(DQ3T)/(DQ3T)/(DQ5T))
LMS_DIQ2_D10: IC8.A4(IO,_DIFFIO_T6n,_(DQ3T)/(DQ3T)/(DQ5T))
LMS_DIQ2_D11: IC8.A3(IO,_DIFFIO_T4n,_(DATA10),_(DQ3T)/(DQ3T)/(DQ5T))
LMS_ENABLE_IQSEL1: IC8.C4(IO,_DIFFIO_T3p,_(DATA12),_(DQS1T/CQ1T#,CDPCLK7)/(DQS1T/CQ1T#,CDPCLK7)/(DQS1T/CQ1T#,CDPCLK7)) ; port LMS_ENABLE_IQSEL1
LMS_ENABLE_IQSEL2: IC8.C7(IO,_DIFFIO_T16p,_(DATA13),_(DM5T/BWS#5T)/(DM3T/BWS#3T)/(DM5T/BWS#5T)) ; port LMS_ENABLE_IQSEL2
LMS_FCLK1: IC8.B20(IO,_PLL2_CLKOUTp) ; port LMS_FCLK1
LMS_FCLK2: IC8.E5(IO,_PLL3_CLKOUTp) ; port LMS_FCLK2
LMS_I2C_SCL: IC8.C17(IO,_DIFFIO_T46p,_(DQ2T)/(DQ5T)/(DQ5T)) ; port LMS_I2C_SCL
LMS_I2C_SDA: IC8.C21(IO,_DIFFIO_R6p,_(DQ2R)/(DQ1R)/(DQ1R)) ; port LMS_I2C_SDA
LMS_RESET: IC8.C6(IO,_DIFFIO_T7n,_(DATA7),_(DQ3T)/(DQ3T)/(DQ5T)) ; port LMS_RESET
LMS_RXEN: IC8.C3(IO,_DIFFIO_T3n,_(DQ3T)/(DQ3T)/(DQ5T)) ; port LMS_RXEN
LMS_TXEN: IC8.B10(IO,_DIFFIO_T25p,_(PADD15)) ; port LMS_TXEN
LMS_TXNRX1: IC8.B9(IO,_DIFFIO_T24p,_(PADD17),_(DQS5T/CQ5T#,DPCLK10)/(DQS5T/CQ5T#,DPCLK10)/(DQS5T/CQ5T#,DPCLK10)) ; port LMS_TXNRX1
LMS_TXNRX2: IC8.B8(IO,_DIFFIO_T20p,_(DATA3),_(DQ5T)/(DQ3T)/(DQ5T)) ; port LMS_TXNRX2
TX1_2_LB_AT: IC8.E15(IO,_DIFFIO_T44n,_(DQ2T)/(DQ5T)/(DQ5T)) ; port TX2_2_LB_AT
TX1_2_LB_H: IC8.H11(IO,_DIFFIO_T14n) ; port TX2_2_LB_H
TX1_2_LB_L: IC8.F11(IO,_DIFFIO_T27p,_(PADD14),_(DM4T)/(DM5T/BWS#5T)/(DM5T/BWS#5T)) ; port TX2_2_LB_L
TX1_2_LB_SH: IC8.F16(IO,_DIFFIO_T51n) ; port TX2_2_LB_SH
TX2_2_LB_AT: IC8.E16(IO,_DIFFIO_T51p,_(DQ2T)/(DQ5T)/(DQ5T)) ; port TX1_2_LB_AT
TX2_2_LB_H: IC8.F15(IO,_DIFFIO_T50n,_(DQ2T)/(DQ5T)/(DQ5T)) ; port TX1_2_LB_H
TX2_2_LB_L: IC8.F14(IO,_DIFFIO_T49p,_(DQS0T/CQ1T,CDPCLK6)/(DQS0T/CQ1T,CDPCLK6)/(DQS0T/CQ1T,CDPCLK6)) ; port TX1_2_LB_L
TX2_2_LB_SH: IC8.G15(IO,_DIFFIO_T49n) ; port TX1_2_LB_SH
NetIC8_B22: IC8.B22(IO,_DIFFIO_R5n,_(PADD22),_(DQ2R)/(DQ1R)/(DQ1R)) ; port PWR_SRC
NetIC8_C8: IC8.C8(IO,_DIFFIO_T16n,_(DATA14),_(DQS3T/CQ3T#,DPCLK11)/(DQS3T/CQ3T#,DPCLK11)/(DQS3T/CQ3T#,DPCLK11)) ; port FPGA_SPI0_MISO
NetIC8_D7: IC8.D7(IO,_DIFFIO_T7p) ; port FPGA_SPI0_MOSI
NetIC8_D10: IC8.D10(IO,_DIFFIO_T26n,_(DQ5T)/(DQ3T)/(DQ5T)) ; port FPGA_SPI0_LMS_SS
NetIC8_E6: IC8.E6(IO,_PLL3_CLKOUTn) ; port FPGA_SPI0_SCLK

Not connected (* = marked no-connect by the designer): IC8 A20(IO,_PLL2_CLKOUTn)* C19(IO,_DIFFIO_T47n,_(DQ2T)/(DQ5T)/(DQ5T))* C20(IO,_DIFFIO_R4n,_(PADD20),_(DQS2R/CQ3R,CDPCLK5)/(DQS2R/CQ3R,CDPCLK5)/(DQS2R/CQ3R,CDPCLK5))* C22(IO,_DIFFIO_R6n,_(DQ2R)/(DQ1R)/(DQ1R))* D13(IO,_DIFFIO_T35p,_(PADD8),_(DQ4T)/(DQ5T)/(DQ5T))* D19(IO,_DIFFIO_T47p,_(DQ2T)/(DQ5T)/(DQ5T))* D21(IO,_DIFFIO_R9p,_(_)/(DQ1R)/(DQ1R))* D22(IO,_DIFFIO_R9n,_(DM2R)/(DM1R/BWS#1R)/(DM1R/BWS#1R))* E7(IO)* E10(IO,_DIFFIO_T26p)* E11(IO,_DIFFIO_T27n,_(PADD13))* E12(IO,_DIFFIO_T28p,_(_)/(DQ5T)/(DQ5T))* E14(IO,_DIFFIO_T38n,_(PADD3),_(DQ4T)/(DQ5T)/(DQ5T))* E21(IO,_DIFFIO_R12p,_(nOE),_(_)/(DQ1R)/(DQ1R))* E22(IO,_DIFFIO_R12n,_(nWE),_(DQ0R)/(DQ1R)/(DQ1R))* F7(IO,_DIFFIO_T1n,_(DM3T/BWS#3T)/(DM3T/BWS#3T)/(DM5T/BWS#5T))* F8(IO,_DIFFIO_T5n,_(DATA9),_(DQ3T)/(DQ3T)/(DQ5T))* F9(IO)* F10(IO,_DIFFIO_T8p,_(DATA6),_(DQ3T)/(DQ3T)/(DQ5T))* F13(IO,_DIFFIO_T37p,_(PADD4),_(DQS2T/CQ3T,DPCLK8)/(DQS2T/CQ3T,DPCLK8)/(DQS2T/CQ3T,DPCLK8))* F17(IO,_DIFFIO_R2n,_(DQ2R)/(DQ1R)/(DQ1R))* F22(IO,_DIFFIO_R18n,_(DQ0R)/(DQ1R)/(DQ1R))* G7(IO,_DIFFIO_T1p)* G8(IO,_DIFFIO_T5p)* G9(IO)* G10(IO,_DIFFIO_T8n)* G11(IO,_DIFFIO_T22n)* G13(IO,_DIFFIO_T42n)* G14(IO,_DIFFIO_T44p)* G16(IO,_DIFFIO_T50p)* G17(IO,_DIFFIO_R2p)* G18(IO,_DIFFIO_R7n,_(PADD23),_(DQ2R)/(DQ1R)/(DQ1R))* H10(IO,_DIFFIO_T14p)* H14(IO,_DIFFIO_T48p)* H15(IO,_DIFFIO_T48n)* H16(IO,_DIFFIO_R10p)* H21(IO,_DIFFIO_R22p,_(DQ0R)/(DQ1R)/(DQ1R))* H22(IO,_DIFFIO_R22n,_(DQ0R)/(DQ1R)/(DQ1R))* J17(IO,_DIFFIO_R10n)* J21(IO,_DIFFIO_R23p,_(DM0R)/(DM1R/BWS#1R)/(DM1R/BWS#1R))* J22(IO,_DIFFIO_R23n,_(DQS0R/CQ1R,DPCLK7)/(DQS0R/CQ1R,DPCLK7)/(DQS0R/CQ1R,DPCLK7))* K17(IO,_DIFFIO_R20n)* K18(IO,_DIFFIO_R20p,_(DQ0R)/(DQ1R)/(DQ1R))* K21(IO,_DIFFIO_R24p,_(CLKUSR))* K22(IO,_DIFFIO_R24n,_(nCEO))* L21(IO,_DIFFIO_R27p,_(CRC_ERROR))* L22(IO,_DIFFIO_R27n,_(INIT_DONE))* P17(IO)* T18(IO,_RDN3)*

### Buses and harness runs
bus FX3_DQ[31..0] = port FX3_DQ[31..0]
bus LMS_DIQ1_D[11..0] = port LMS_DIQ1_D[11..0]
bus LMS_DIQ2_D[11..0] = port LMS_DIQ2_D[11..0]

### Notes on the sheet
- NF elements on sheet: R49
- Number of NF elements on sheet: 1
- FPGA banks 5, 6, 7, 8
- VCC1P8
- VDIO_LMS_FPGA
- (near IC8) HW_VER = 4 [0 1 0 0]
- HW_VER0
- HW_VER1
- HW_VER2
- HW_VER3
- (near IC8) PWR_SRC(output) LOW->VBUS ; HIGH->VIN
- OTG B MODE:
- PWR_SRC(input) LOW->VBUS ; HIGH->VIN
- (near IC8) PWR_SRC status:
- (near IC8) OTG A MODE:
- Project name:
- Title:
- Size:
- Date:
- A3
- Revision:
- Time:
- Sheet
- of
- File:
- (in symbol EP4CE40F23C7N, part E) BANK 5
- (in symbol EP4CE40F23C7N, part F) BANK 6
- (in symbol EP4CE40F23C7N, part G) BANK 7
- (in symbol EP4CE40F23C7N, part H) BANK 8

### Library data of the parts
IC8 = EP4CE40F23C7N: IC FPGA 328 I/O 484FBGA; Manufacturer: Altera; Number of I/O: 328; Number of LABs/CLBs: 2475; Number of Logic Elements/Cells: 39600; Total RAM Bits: 1161216; Voltage - Supply: 1.15 V ~ 1.25 V; DatasheetVersion: ver1.6, Nov-2011; PackageDescription: 484-Pin FineLine Ball Grid Array (FBGA) - Wire Bond - A:2.40; Code_JEDEC: MS-034-AAJ-1; ComponentLink1Description: Manufacturer URL; ComponentLink1URL: http://www.altera.com/; ComponentLink2Description: Handbook; ComponentLink2URL: http://www.altera.com/literature/hb/cyclone-iv/cyclone4-handbook.pdf; ComponentLink3Description: Pinout; ComponentLink3URL: http://www.altera.com/literature/lit-dp.jsp?category=cyc%204&showspreadsheet=y; ComponentLink4Description: Package Specification; ComponentLink4URL: http://www.altera.com/devicepackaging/04R00247-02.pdf; Category: Integrated Circuits (ICs); Manufacturer Part Number 1: EP4CE40F23C8N; Mounting Type: Surface Mount; Number of Gates: -; Operating Temperature: 0°C ~ 85°C; Package / Case: 484-BGA; RoHS: RoHS Compliant; Supplier 1: Digi-Key; Supplier Device Package: 484-FBGA (23x23); Supplier Part Number 1: 544-2811-ND; Part Description: IC FPGA 328 I/O 484FBGA